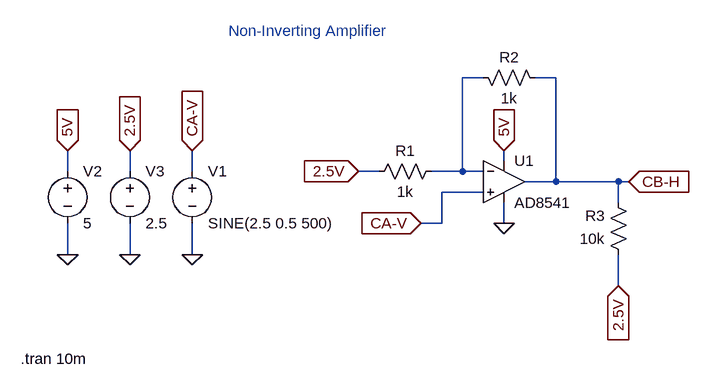
[diagram p0: schematic non_inverting_amplifier.asc]
non_inverting_amplifier.asc, the LTspice schematic file:
Version 4
SHEET 1 880 680
WIRE 528 16 496 16
WIRE 640 16 608 16
WIRE 560 144 560 128
WIRE -112 160 -112 128
WIRE -16 160 -16 128
WIRE 80 160 80 128
WIRE 368 160 336 160
WIRE 496 160 496 16
WIRE 496 160 448 160
WIRE 528 160 496 160
WIRE 640 176 640 16
WIRE 640 176 592 176
WIRE 736 176 640 176
WIRE 752 176 736 176
WIRE 528 192 464 192
WIRE 736 208 736 176
WIRE 464 240 464 192
WIRE 464 240 432 240
WIRE 560 240 560 208
WIRE -112 288 -112 240
WIRE -16 288 -16 240
WIRE 80 288 80 240
WIRE 736 336 736 288
FLAG 80 288 0
FLAG -112 288 0
FLAG 80 128 CA-V
IOPIN 80 128 In
FLAG 432 240 CA-V
IOPIN 432 240 In
FLAG -112 128 5V
IOPIN -112 128 In
FLAG 736 336 2.5V
IOPIN 736 336 In
FLAG 560 240 0
FLAG -16 288 0
FLAG -16 128 2.5V
IOPIN -16 128 In
FLAG 560 128 5V
IOPIN 560 128 In
FLAG 752 176 CB-H
IOPIN 752 176 In
FLAG 336 160 2.5V
IOPIN 336 160 In
SYMBOL Opamps\\AD8541 560 112 R0
SYMATTR InstName U1
SYMBOL res 752 304 R180
WINDOW 0 36 76 Left 2
WINDOW 3 36 40 Left 2
SYMATTR InstName R3
SYMATTR Value 10k
SYMBOL res 464 144 R90
WINDOW 0 0 56 VBottom 2
WINDOW 3 32 56 VTop 2
SYMATTR InstName R1
SYMATTR Value 1k
SYMBOL voltage 80 144 R0
WINDOW 123 0 0 Left 0
WINDOW 39 0 0 Left 0
SYMATTR InstName V1
SYMATTR Value SINE(2.5 0.5 500)
SYMBOL voltage -112 144 R0
WINDOW 123 0 0 Left 0
WINDOW 39 0 0 Left 0
SYMATTR InstName V2
SYMATTR Value 5
SYMBOL voltage -16 144 R0
WINDOW 123 0 0 Left 0
WINDOW 39 0 0 Left 0
SYMATTR InstName V3
SYMATTR Value 2.5
SYMBOL res 512 0 M90
WINDOW 0 0 56 VBottom 2
WINDOW 3 32 56 VTop 2
SYMATTR InstName R2
SYMATTR Value 1k
TEXT -184 448 Left 2 !.tran 10m
TEXT 136 -56 Left 2 ;Non-Inverting Amplifier

The netlist it stands for:
* non_inverting_amplifier.asc
XU1 CA-V N001 5V 0 CB-H AD8541  ; pins In+ In- V+ V- OUT
R3 2.5V CB-H 10k
R1 N001 2.5V 1k
V1 CA-V 0 SINE(2.5 0.5 500)
V2 5V 0 5
V3 2.5V 0 2.5
R2 N001 CB-H 1k
.tran 10m
* Non-Inverting Amplifier
.backanno
.end